# EAGLE schematic Solar Tracker(without using ATmega328P) (EAGLE 9.6.0)
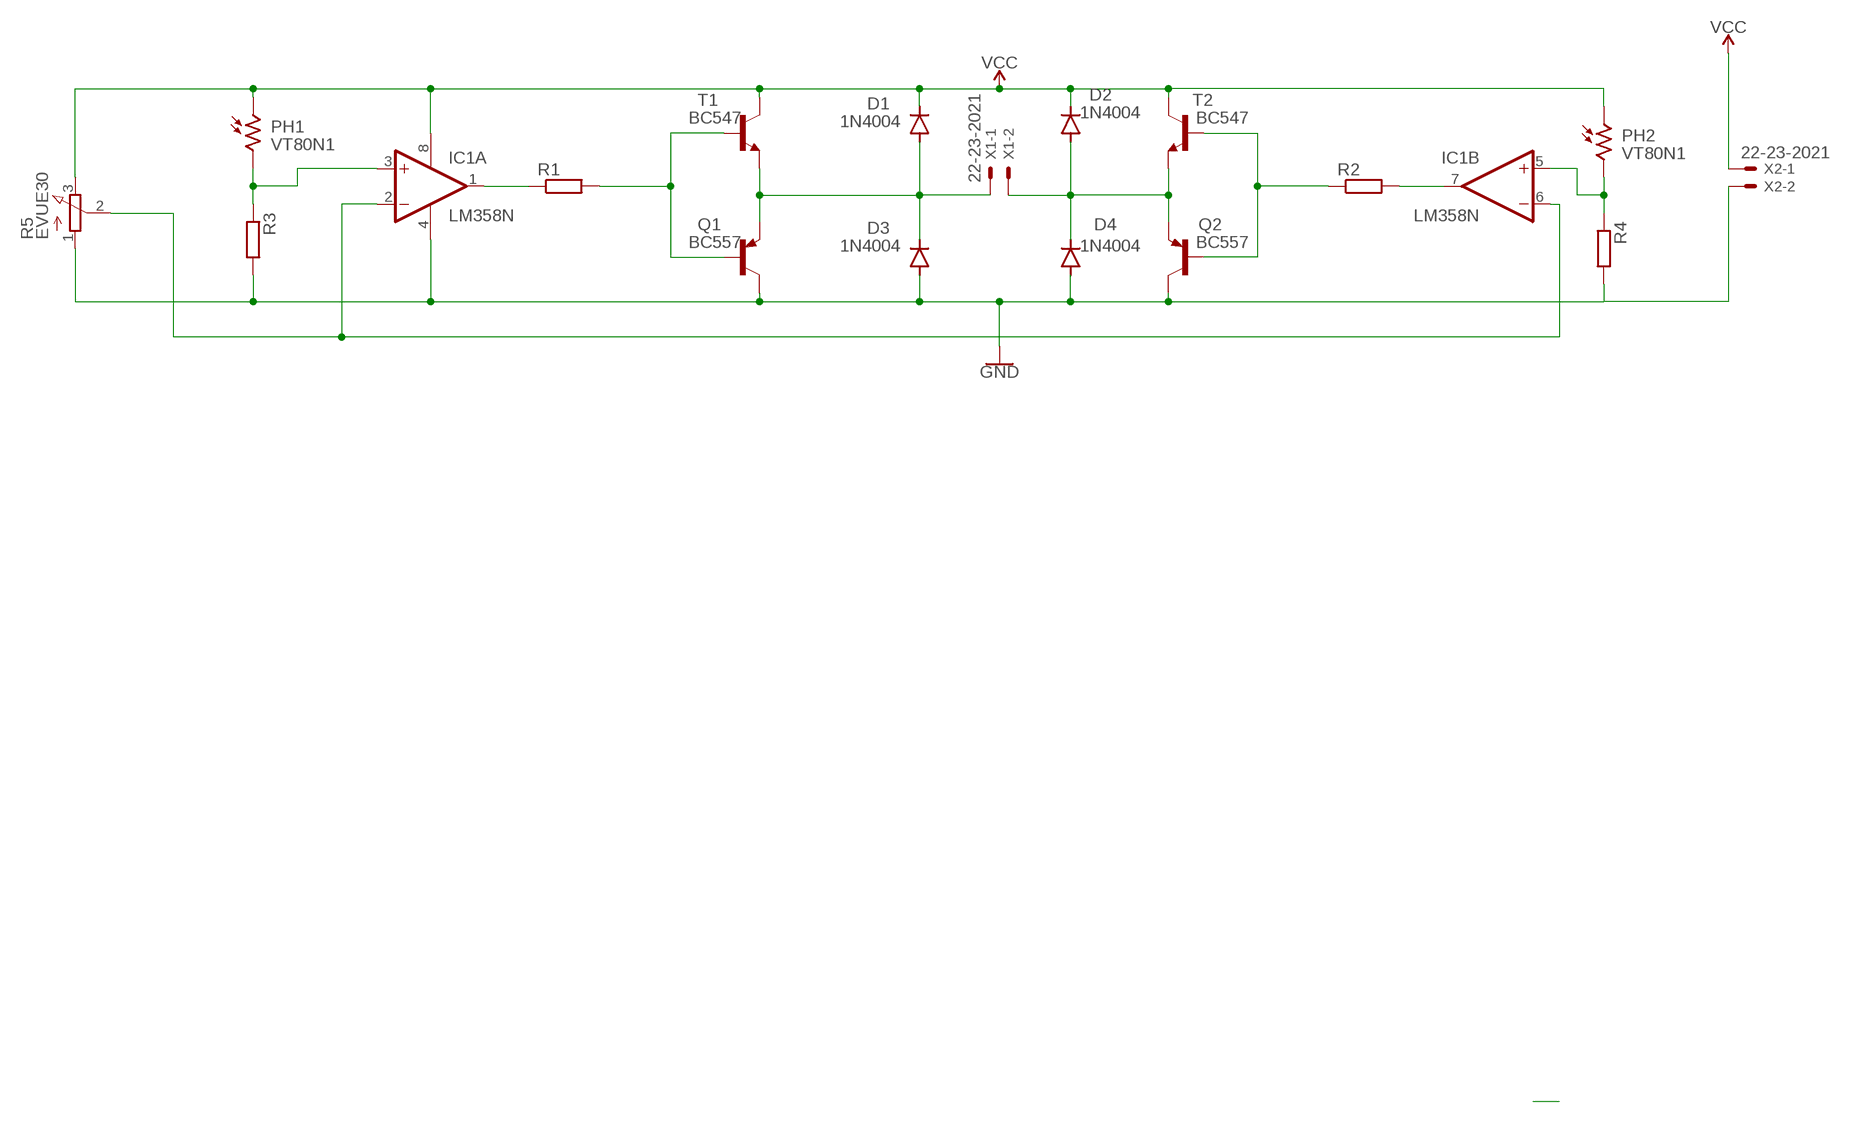
[diagram p0: schematic, sheet 1]

## Parts
D1  1N4004  [DO41-10]
D2  1N4004  [DO41-10]
D3  1N4004  [DO41-10]
D4  1N4004  [DO41-10]
IC1  LM358N  [DIL08]
PH1  VT80N1  [VT800]
PH2  VT80N1  [VT800]
Q1  BC557  [TO92]
Q2  BC557  [TO92]
R1  R-EU_0204/7  [0204/7]
R2  R-EU_0204/7  [0204/7]
R3  R-EU_0204/7  [0204/7]
R4  R-EU_0204/7  [0204/7]
R5  EVUE30  [EVUE]
T1  BC547  [TO92]
T2  BC547  [TO92]
X1  22-23-2021  [22-23-2021]
X2  22-23-2021  [22-23-2021]

## Nets
GND: D3.A D4.A IC1.4(P:V-) Q1.3(C) Q2.3(C) R3.2 R4.2 R5.1(A) X2.2
N$1: D1.A D3.C Q1.1(E) T1.1(E) X1.1
N$2: D2.A D4.C Q2.1(E) T2.1(E) X1.2
N$6: Q2.2(B) R2.1 T2.2(B)
N$7: Q1.2(B) R1.2 T1.2(B)
N$8: IC1.5(B:+IN) PH2.2 R4.1
N$9: IC1.7(B:OUT) R2.2
N$10: IC1.1(A:OUT) R1.1
N$11: IC1.3(A:+IN) PH1.2 R3.1
N$14: IC1.2(A:-IN) IC1.6(B:-IN) R5.2(S)
VCC: D1.C D2.C IC1.8(P:V+) PH1.1 PH2.1 R5.3(E) T1.3(C) T2.3(C) X2.1

## Library data of the parts
D1-D4 = diode:1N4004: DIODE general purpose rectifier, 1 A
IC1 = linear:LM358: OP AMP also LM158; LM258; LM2904 Source: http://cache.national.com/ds/LM/LM158.pdf
PH1 PH2 = photo-elements:VT8: Photoconductive Cell VT800 Series Source: http://optoelectronics.perkinelmer.com/content/Datasheets/DTS_vt800seriesdatasheet.pdf
Q1 Q2 = transistor-pnp:BC557: PNP Transistor
R1-R4 = rcl:R-EU_: RESISTOR, European symbol; SPICEPREFIX: R
R5 = pot:EVU: 9 mm Square Rotary Potentiometers Source: Panasonic
T1 T2 = transistor:BC547: NPN TRANSISTOR
X1 X2 = con-molex:22-23-2021: .100" (2.54mm) Center Header - 2 Pin; MF: MOLEX; MPN: 22-23-2021; OC_FARNELL: 1462926; OC_NEWARK: 25C3832

## Net classes
0 default: width 0.305 mm, drill 0.508 mm, clearance 0.254 mm